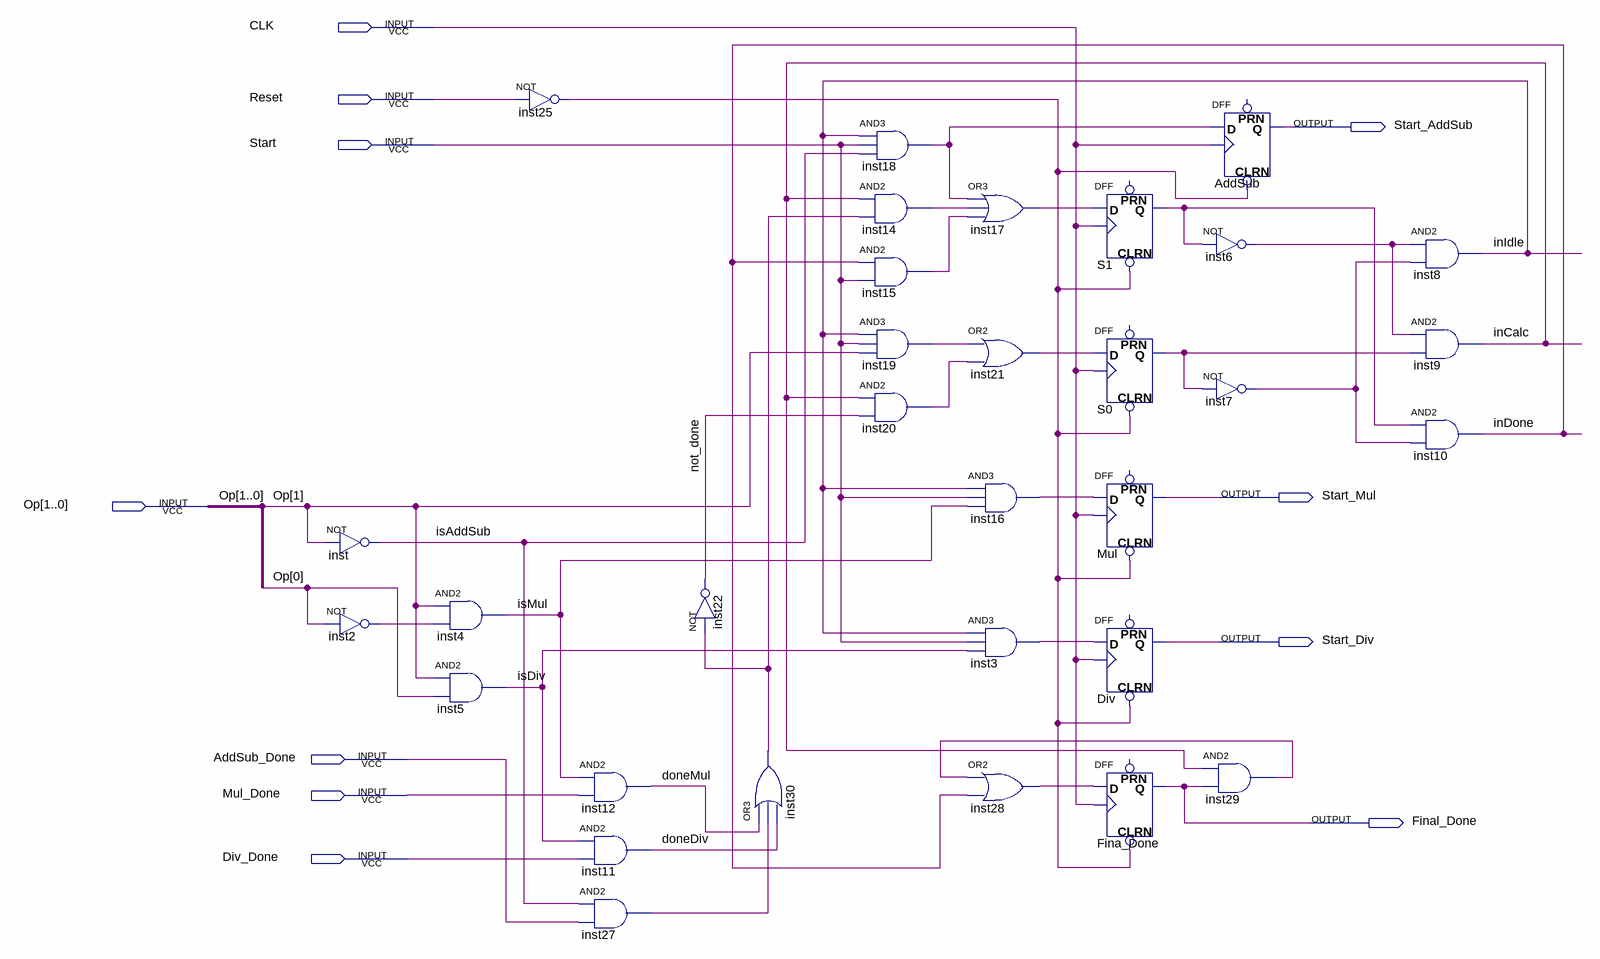
[diagram p0: schematic sheet]
// Quartus schematic Controller_FPU.bdf as structural Verilog: 32 symbols, 11 pins
module Controller_FPU (
  input  CLK,
  input  Reset,
  input  Start,
  input  [1:0] Op,
  input  AddSub_Done,
  input  Mul_Done,
  input  Div_Done,
  output Start_AddSub,
  output Start_Mul,
  output Start_Div,
  output Final_Done
);

  wire doneDiv, doneMul, inCalc, inDone, inIdle, inst2_out, inst3_out, inst6_out, inst7_out, inst14_out,
       inst15_out, inst16_out, inst17_out, inst18_out, inst19_out, inst20_out, inst21_out, inst25_out,
       inst27_out, inst28_out, inst29_out, inst30_out, isAddSub, isDiv, isMul, not_done, S0_q, S1_q;

  not inst (isAddSub, Op[1]);
  not inst2 (inst2_out, Op[0]);
  and inst4 (isMul, Op[1], inst2_out);
  and inst5 (isDiv, Op[1], Op[0]);
  not inst25 (inst25_out, Reset);
  and inst12 (doneMul, isMul, Mul_Done);
  and inst11 (doneDiv, isDiv, Div_Done);
  and inst27 (inst27_out, isAddSub, AddSub_Done);
  not inst22 (not_done, inst30_out);
  or inst30 (inst30_out, doneMul, inst27_out, doneDiv);
  and inst18 (inst18_out, inIdle, Start, isAddSub);
  and inst14 (inst14_out, inCalc, inst30_out);
  and inst15 (inst15_out, inDone, Start);
  and inst19 (inst19_out, inIdle, Start, Op[1]);
  and inst20 (inst20_out, inCalc, not_done);
  or inst17 (inst17_out, inst18_out, inst14_out, inst15_out);
  or inst21 (inst21_out, inst19_out, inst20_out);
  and inst16 (inst16_out, inIdle, Start, isMul);
  and inst3 (inst3_out, inIdle, Start, isDiv);
  or inst28 (inst28_out, inst29_out, inDone);
  DFF S1 (.CLRN(inst25_out), .CLK(CLK), .D(inst17_out), .Q(S1_q));  // open: PRN
  DFF S0 (.CLRN(inst25_out), .CLK(CLK), .D(inst21_out), .Q(S0_q));  // open: PRN
  DFF Mul (.CLRN(inst25_out), .CLK(CLK), .D(inst16_out), .Q(Start_Mul));  // open: PRN
  DFF Div (.CLRN(inst25_out), .CLK(CLK), .D(inst3_out), .Q(Start_Div));  // open: PRN
  DFF Fina_Done (.CLRN(inst25_out), .CLK(CLK), .D(inst28_out), .Q(Final_Done));  // open: PRN
  DFF AddSub (.CLRN(inst25_out), .CLK(CLK), .D(inst18_out), .Q(Start_AddSub));  // open: PRN
  not inst6 (inst6_out, S1_q);
  not inst7 (inst7_out, S0_q);
  and inst29 (inst29_out, inCalc, Final_Done);
  and inst8 (inIdle, inst6_out, inst7_out);
  and inst9 (inCalc, inst6_out, S0_q);
  and inst10 (inDone, S1_q, inst7_out);
endmodule
